# Altium schematic sheet TX.SchDoc
size 420 x 297 mm; SheetNumber: 2; SheetTotal: 4
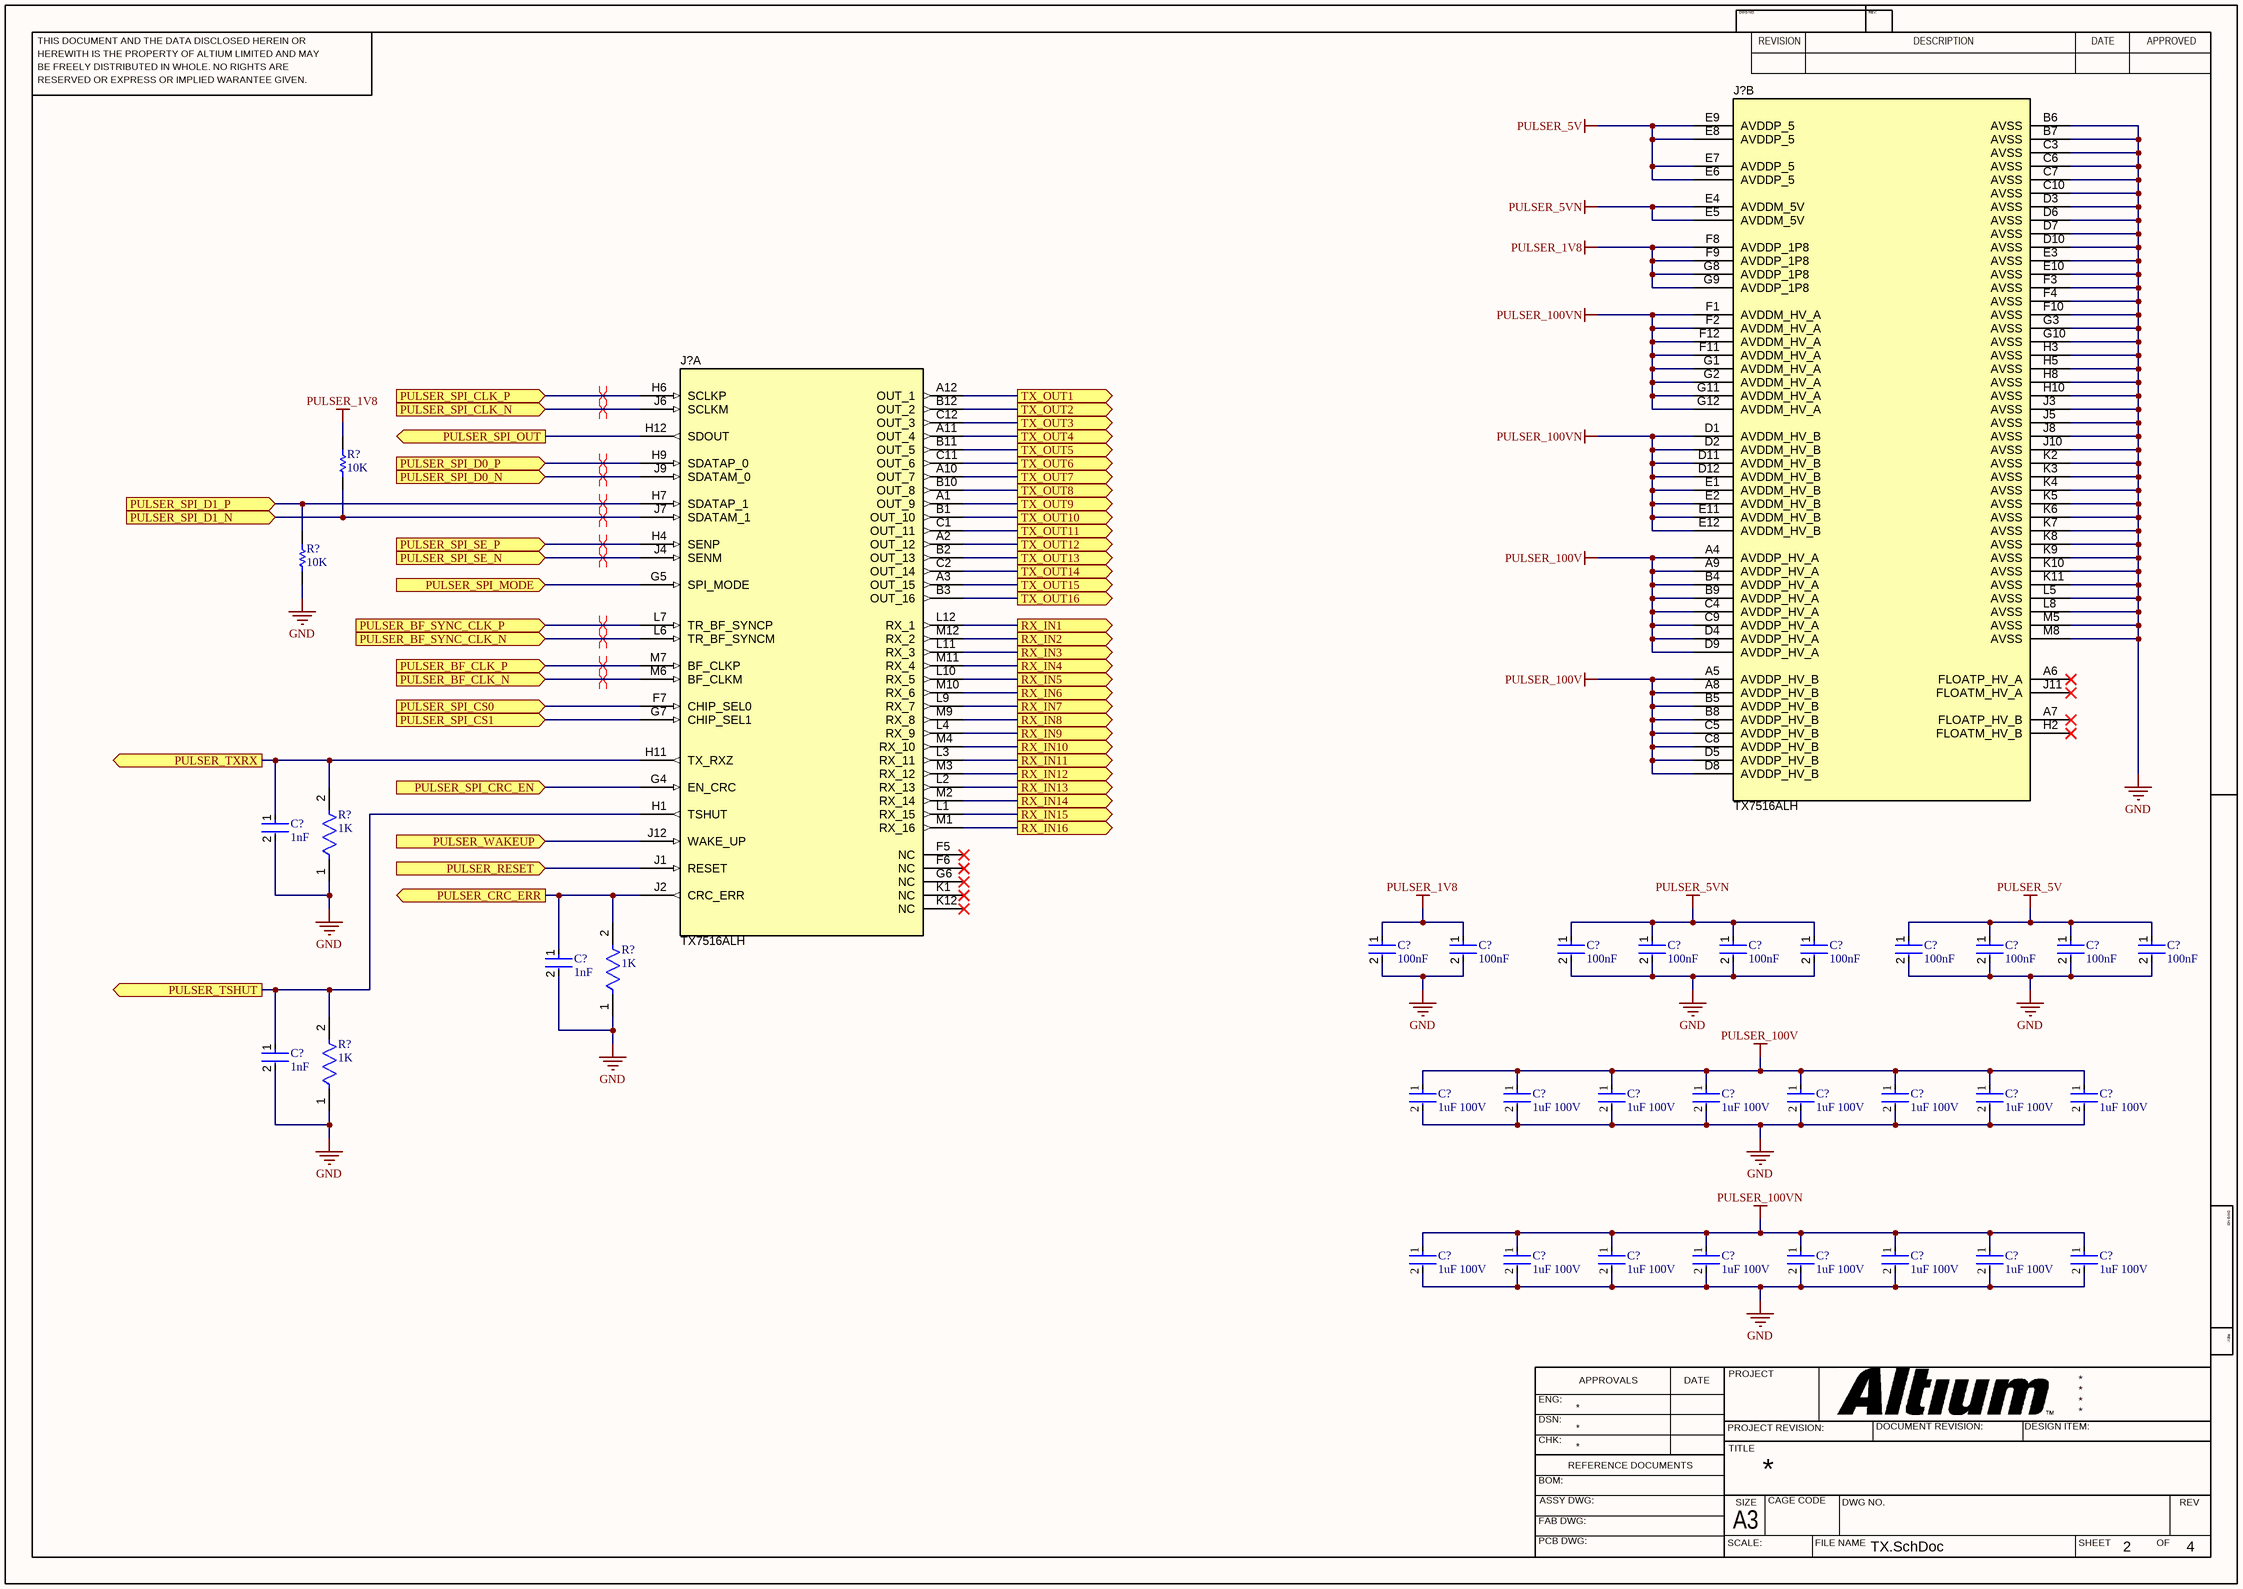
[diagram p0: TX.SchDoc]

## Parts
(Parts that share a designator on the sheet are numbered #1, #2 ... from top to bottom, then left to right.)
C?#1  1nF  [FP-C0402-BB-MFG]
C?#2  100nF  [FP-C0402-BB-MFG]
C?#3  100nF  [FP-C0402-BB-MFG]
C?#4  100nF  [FP-C0402-BB-MFG]
C?#5  100nF  [FP-C0402-BB-MFG]
C?#6  100nF  [FP-C0402-BB-MFG]
C?#7  100nF  [FP-C0402-BB-MFG]
C?#8  100nF  [FP-C0402-BB-MFG]
C?#9  100nF  [FP-C0402-BB-MFG]
C?#10  100nF  [FP-C0402-BB-MFG]
C?#11  100nF  [FP-C0402-BB-MFG]
C?#12  1nF  [FP-C0402-BB-MFG]
C?#13  1nF  [FP-C0402-BB-MFG]
C?#14  1uF 100V  [FP-0805-L_2_01_0_2-W_1_25-MFG]
C?#15  1uF 100V  [FP-0805-L_2_01_0_2-W_1_25-MFG]
C?#16  1uF 100V  [FP-0805-L_2_01_0_2-W_1_25-MFG]
C?#17  1uF 100V  [FP-0805-L_2_01_0_2-W_1_25-MFG]
C?#18  1uF 100V  [FP-0805-L_2_01_0_2-W_1_25-MFG]
C?#19  1uF 100V  [FP-0805-L_2_01_0_2-W_1_25-MFG]
C?#20  1uF 100V  [FP-0805-L_2_01_0_2-W_1_25-MFG]
C?#21  1uF 100V  [FP-0805-L_2_01_0_2-W_1_25-MFG]
C?#22  1uF 100V  [FP-0805-L_2_01_0_2-W_1_25-MFG]
C?#23  1uF 100V  [FP-0805-L_2_01_0_2-W_1_25-MFG]
C?#24  1uF 100V  [FP-0805-L_2_01_0_2-W_1_25-MFG]
C?#25  1uF 100V  [FP-0805-L_2_01_0_2-W_1_25-MFG]
C?#26  1uF 100V  [FP-0805-L_2_01_0_2-W_1_25-MFG]
C?#27  1uF 100V  [FP-0805-L_2_01_0_2-W_1_25-MFG]
C?#28  1uF 100V  [FP-0805-L_2_01_0_2-W_1_25-MFG]
C?#29  1uF 100V  [FP-0805-L_2_01_0_2-W_1_25-MFG]
J?#1  TX7516ALH  [ALH0144A]  (part B of 2)
J?#2  TX7516ALH  [ALH0144A]  (part A of 2)
R?#1  10K  [RESC1005X40X20NL05T10]
R?#2  10K  [RESC1005X40X20NL05T10]
R?#3  1K  [FP-CRGCQ0402-IPC_C]
R?#4  1K  [FP-CRGCQ0402-IPC_C]
R?#5  1K  [FP-CRGCQ0402-IPC_C]

## Ports
PULSER_BF_CLK_N (in), PULSER_BF_CLK_P (in), PULSER_BF_SYNC_CLK_N (in), PULSER_BF_SYNC_CLK_P (in), PULSER_CRC_ERR (out), PULSER_RESET (in), PULSER_SPI_CLK_N (in), PULSER_SPI_CLK_P (in), PULSER_SPI_CRC_EN (in), PULSER_SPI_CS0 (in), PULSER_SPI_CS1 (in), PULSER_SPI_D0_N (in), PULSER_SPI_D0_P (in), PULSER_SPI_D1_N (in), PULSER_SPI_D1_P (in), PULSER_SPI_MODE (in), PULSER_SPI_OUT (out), PULSER_SPI_SE_N (in), PULSER_SPI_SE_P (in), PULSER_TSHUT (out), PULSER_TXRX (out), PULSER_WAKEUP (in), RX_IN1 (out), RX_IN2 (out), RX_IN3 (out), RX_IN4 (out), RX_IN5 (out), RX_IN6 (out), RX_IN7 (out), RX_IN8 (out), RX_IN9 (out), RX_IN10 (out), RX_IN11 (out), RX_IN12 (out), RX_IN13 (out), RX_IN14 (out), RX_IN15 (out), RX_IN16 (out), TX_OUT1 (out), TX_OUT2 (out), TX_OUT3 (out), TX_OUT4 (out), TX_OUT5 (out), TX_OUT6 (out), TX_OUT7 (out), TX_OUT8 (out), TX_OUT9 (out), TX_OUT10 (out), TX_OUT11 (out), TX_OUT12 (out), TX_OUT13 (out), TX_OUT14 (out), TX_OUT15 (out), TX_OUT16 (out)

## Nets
GND: C?#1.2 C?#2.2 C?#3.2 C?#4.2 C?#5.2 C?#6.2 C?#7.2 C?#8.2 C?#9.2 C?#10.2 C?#11.2 C?#12.2 C?#13.2 C?#14.2 C?#15.2 C?#16.2 C?#17.2 C?#18.2 C?#19.2 C?#20.2 C?#21.2 C?#22.2 C?#23.2 C?#24.2 C?#25.2 C?#26.2 C?#27.2 C?#28.2 C?#29.2 J?#1.B6(AVSS) J?#1.B7(AVSS) J?#1.C3(AVSS) J?#1.C6(AVSS) J?#1.C7(AVSS) J?#1.C10(AVSS) J?#1.D3(AVSS) J?#1.D6(AVSS) J?#1.D7(AVSS) J?#1.D10(AVSS) J?#1.E3(AVSS) J?#1.E10(AVSS) J?#1.F3(AVSS) J?#1.F4(AVSS) J?#1.F10(AVSS) J?#1.G3(AVSS) J?#1.G10(AVSS) J?#1.H3(AVSS) J?#1.H5(AVSS) J?#1.H8(AVSS) J?#1.H10(AVSS) J?#1.J3(AVSS) J?#1.J5(AVSS) J?#1.J8(AVSS) J?#1.J10(AVSS) J?#1.K2(AVSS) J?#1.K3(AVSS) J?#1.K4(AVSS) J?#1.K5(AVSS) J?#1.K6(AVSS) J?#1.K7(AVSS) J?#1.K8(AVSS) J?#1.K9(AVSS) J?#1.K10(AVSS) J?#1.K11(AVSS) J?#1.L5(AVSS) J?#1.L8(AVSS) J?#1.M5(AVSS) J?#1.M8(AVSS) R?#2.1 R?#3.1 R?#4.1 R?#5.1
PULSER_1V8: C?#2.1 C?#3.1 J?#1.F8(AVDDP_1P8) J?#1.F9(AVDDP_1P8) J?#1.G8(AVDDP_1P8) J?#1.G9(AVDDP_1P8) R?#1.2
PULSER_5V: C?#8.1 C?#9.1 C?#10.1 C?#11.1 J?#1.E6(AVDDP_5) J?#1.E7(AVDDP_5) J?#1.E8(AVDDP_5) J?#1.E9(AVDDP_5)
PULSER_5VN: C?#4.1 C?#5.1 C?#6.1 C?#7.1 J?#1.E4(AVDDM_5V) J?#1.E5(AVDDM_5V)
PULSER_100V: C?#14.1 C?#15.1 C?#16.1 C?#17.1 C?#18.1 C?#19.1 C?#20.1 C?#21.1 J?#1.A4(AVDDP_HV_A) J?#1.A5(AVDDP_HV_B) J?#1.A8(AVDDP_HV_B) J?#1.A9(AVDDP_HV_A) J?#1.B4(AVDDP_HV_A) J?#1.B5(AVDDP_HV_B) J?#1.B8(AVDDP_HV_B) J?#1.B9(AVDDP_HV_A) J?#1.C4(AVDDP_HV_A) J?#1.C5(AVDDP_HV_B) J?#1.C8(AVDDP_HV_B) J?#1.C9(AVDDP_HV_A) J?#1.D4(AVDDP_HV_A) J?#1.D5(AVDDP_HV_B) J?#1.D8(AVDDP_HV_B) J?#1.D9(AVDDP_HV_A)
PULSER_100VN: C?#22.1 C?#23.1 C?#24.1 C?#25.1 C?#26.1 C?#27.1 C?#28.1 C?#29.1 J?#1.D1(AVDDM_HV_B) J?#1.D2(AVDDM_HV_B) J?#1.D11(AVDDM_HV_B) J?#1.D12(AVDDM_HV_B) J?#1.E1(AVDDM_HV_B) J?#1.E2(AVDDM_HV_B) J?#1.E11(AVDDM_HV_B) J?#1.E12(AVDDM_HV_B) J?#1.F1(AVDDM_HV_A) J?#1.F2(AVDDM_HV_A) J?#1.F11(AVDDM_HV_A) J?#1.F12(AVDDM_HV_A) J?#1.G1(AVDDM_HV_A) J?#1.G2(AVDDM_HV_A) J?#1.G11(AVDDM_HV_A) J?#1.G12(AVDDM_HV_A)
PULSER_BF_CLK_N: J?#2.M6(BF_CLKM) ; port PULSER_BF_CLK_N
PULSER_BF_CLK_P: J?#2.M7(BF_CLKP) ; port PULSER_BF_CLK_P
PULSER_BF_SYNC_CLK_N: J?#2.L6(TR_BF_SYNCM) ; port PULSER_BF_SYNC_CLK_N
PULSER_BF_SYNC_CLK_P: J?#2.L7(TR_BF_SYNCP) ; port PULSER_BF_SYNC_CLK_P
PULSER_CRC_ERR: C?#12.1 J?#2.J2(CRC_ERR) R?#4.2 ; port PULSER_CRC_ERR
PULSER_RESET: J?#2.J1(RESET) ; port PULSER_RESET
PULSER_SPI_CLK_N: J?#2.J6(SCLKM) ; port PULSER_SPI_CLK_N
PULSER_SPI_CLK_P: J?#2.H6(SCLKP) ; port PULSER_SPI_CLK_P
PULSER_SPI_CRC_EN: J?#2.G4(EN_CRC) ; port PULSER_SPI_CRC_EN
PULSER_SPI_CS0: J?#2.F7(CHIP_SEL0) ; port PULSER_SPI_CS0
PULSER_SPI_CS1: J?#2.G7(CHIP_SEL1) ; port PULSER_SPI_CS1
PULSER_SPI_D0_N: J?#2.J9(SDATAM_0) ; port PULSER_SPI_D0_N
PULSER_SPI_D0_P: J?#2.H9(SDATAP_0) ; port PULSER_SPI_D0_P
PULSER_SPI_D1_N: J?#2.J7(SDATAM_1) R?#1.1 ; port PULSER_SPI_D1_N
PULSER_SPI_D1_P: J?#2.H7(SDATAP_1) R?#2.2 ; port PULSER_SPI_D1_P
PULSER_SPI_MODE: J?#2.G5(SPI_MODE) ; port PULSER_SPI_MODE
PULSER_SPI_OUT: J?#2.H12(SDOUT) ; port PULSER_SPI_OUT
PULSER_SPI_SE_N: J?#2.J4(SENM) ; port PULSER_SPI_SE_N
PULSER_SPI_SE_P: J?#2.H4(SENP) ; port PULSER_SPI_SE_P
PULSER_TSHUT: C?#13.1 J?#2.H1(TSHUT) R?#5.2 ; port PULSER_TSHUT
PULSER_TXRX: C?#1.1 J?#2.H11(TX_RXZ) R?#3.2 ; port PULSER_TXRX
PULSER_WAKEUP: J?#2.J12(WAKE_UP) ; port PULSER_WAKEUP
RX_IN1: J?#2.L12(RX_1) ; port RX_IN1
RX_IN2: J?#2.M12(RX_2) ; port RX_IN2
RX_IN3: J?#2.L11(RX_3) ; port RX_IN3
RX_IN4: J?#2.M11(RX_4) ; port RX_IN4
RX_IN5: J?#2.L10(RX_5) ; port RX_IN5
RX_IN6: J?#2.M10(RX_6) ; port RX_IN6
RX_IN7: J?#2.L9(RX_7) ; port RX_IN7
RX_IN8: J?#2.M9(RX_8) ; port RX_IN8
RX_IN9: J?#2.L4(RX_9) ; port RX_IN9
RX_IN10: J?#2.M4(RX_10) ; port RX_IN10
RX_IN11: J?#2.L3(RX_11) ; port RX_IN11
RX_IN12: J?#2.M3(RX_12) ; port RX_IN12
RX_IN13: J?#2.L2(RX_13) ; port RX_IN13
RX_IN14: J?#2.M2(RX_14) ; port RX_IN14
RX_IN15: J?#2.L1(RX_15) ; port RX_IN15
RX_IN16: J?#2.M1(RX_16) ; port RX_IN16
TX_OUT1: J?#2.A12(OUT_1) ; port TX_OUT1
TX_OUT2: J?#2.B12(OUT_2) ; port TX_OUT2
TX_OUT3: J?#2.C12(OUT_3) ; port TX_OUT3
TX_OUT4: J?#2.A11(OUT_4) ; port TX_OUT4
TX_OUT5: J?#2.B11(OUT_5) ; port TX_OUT5
TX_OUT6: J?#2.C11(OUT_6) ; port TX_OUT6
TX_OUT7: J?#2.A10(OUT_7) ; port TX_OUT7
TX_OUT8: J?#2.B10(OUT_8) ; port TX_OUT8
TX_OUT9: J?#2.A1(OUT_9) ; port TX_OUT9
TX_OUT10: J?#2.B1(OUT_10) ; port TX_OUT10
TX_OUT11: J?#2.C1(OUT_11) ; port TX_OUT11
TX_OUT12: J?#2.A2(OUT_12) ; port TX_OUT12
TX_OUT13: J?#2.B2(OUT_13) ; port TX_OUT13
TX_OUT14: J?#2.C2(OUT_14) ; port TX_OUT14
TX_OUT15: J?#2.A3(OUT_15) ; port TX_OUT15
TX_OUT16: J?#2.B3(OUT_16) ; port TX_OUT16

Not connected (* = marked no-connect by the designer): J?#1 A6(FLOATP_HV_A)* A7(FLOATP_HV_B)* H2(FLOATM_HV_B)* J11(FLOATM_HV_A)*; J?#2 F5(NC)* F6(NC)* G6(NC)* K1(NC)* K12(NC)*

## Layout directives
differential pair: PULSER_BF_CLK_N, PULSER_BF_CLK_P, PULSER_BF_SYNC_CLK_N, PULSER_BF_SYNC_CLK_P, PULSER_SPI_CLK_N, PULSER_SPI_CLK_P, PULSER_SPI_D0_N, PULSER_SPI_D0_P, PULSER_SPI_D1_N, PULSER_SPI_D1_P, PULSER_SPI_SE_N, PULSER_SPI_SE_P

## Notes on the sheet
- THIS DOCUMENT AND THE DATA DISCLOSED HEREIN OR
- HEREWITH IS THE PROPERTY OF ALTIUM LIMITED AND MAY
- DWG NO:
- REVISION
- REV:
- DESCRIPTION
- DATE
- APPROVED
- BE FREELY DISTRIBUTED IN WHOLE. NO RIGHTS ARE
- RESERVED OR EXPRESS OR IMPLIED WARANTEE GIVEN.
- ENG:
- APPROVALS
- PROJECT
- DSN:
- CHK:
- REFERENCE DOCUMENTS
- PROJECT REVISION:
- TITLE
- DOCUMENT REVISION:
- DESIGN ITEM:
- BOM:
- FAB DWG:
- PCB DWG:
- ASSY DWG:
- SCALE:
- A3
- SIZE
- CAGE CODE
- FILE NAME
- DWG NO.
- SHEET
- OF
- REV

## Library data of the parts
C?#1 C?#12 C?#13 = CMP-03020-001048-2: CAP CER 1000PF 16V C0G/NP0 0402 - C0402C102J4GAC7867; Manufacturer: Kemet; Temperature Coefficient: 15%; Capacitance: 1,000 pF; Value: 1,000 pF; Material: Ceramic; Description: C0402 1,000 pF C0G 5.00% 16 V; Tolerance: 0.05; Temperature Characteristic: C0G; Temperature Range Low: -55°C; Height: 0.55mm; ComponentLink2URL: https://content.kemet.com/datasheets/KEM_C1002_X7R_SMD.pdf; Ipc Land Pattern Name: CAPC10050X50; Manufacturer Part Number: C0402C102J4GAC7867; Digikey Description: CAP CER 1000PF 16V C0G/NP0 0402; Voltage Rating: 16 V; Device Class L1: Passive Components; Category: Cap; Automotive: No; Lead Free: Yes; Temperature: -55°C to +125°C; Device Class L3: Ceramic Capacitors; ComponentLink2Description: Datasheet; Octopart: https://octopart.com/c0402c102j4gac7867-kemet-73410369; Package: C0402-BB; Temperature Range High: +125°C; RoHS: TRUE; Device Class L2: Capacitors
C?#2-C?#11 = CMP-2008-02108-2: CAP CER 0.1UF 16V X7R 0402 - C0402C104K4RACTU; Manufacturer: Kemet; Value: 0.10 μF; Tolerance: 0.1; Description: C0402 0.10 μF X7R 10.00% 16 V; Material: Ceramic; Temperature Coefficient: 15%; Voltage Rating: 16 V; Package: C0402-BB; Automotive: No; Ipc Land Pattern Name: CAPC10050X50; Device Class L3: Ceramic Capacitors; Capacitance: 0.10 μF; Octopart: https://octopart.com/c0402c104k4ractu-kemet-94158; Temperature Characteristic: X7R; Mouser Description: Cap Ceramic 0.1uF 16V X7R 10% SMD 0402 125?C Paper T/R - Tape and Reel (Alt: C0402C104K4RAC TU); ComponentLink2Description: Datasheet; Temperature Range Low: -55°C; RoHS: TRUE; Device Class L1: Passive Components; Manufacturer Part Number: C0402C104K4RACTU; Temperature Range High: +125°C; Device Class L2: Capacitors; ComponentLink2URL: https://content.kemet.com/datasheets/KEM_C1002_X7R_SMD.pdf; Category: Cap; Height: 0.55mm; Temperature: -55°C to +125°C; Lead Free: Yes; Digikey Description: CAP CER 0.1UF 16V X7R 0402
C?#14-C?#29 = CMP-07738-122049624-1: 08051C105K4T2A Cap Ceramic 1uF 100V X7R 10% Pad SMD 0805 125C Automotive T/R - 08051C105K4T2A; Capacitance: 1µF; Tolerance: 10%; Dielectric: X7R; Case/Package: 0805; Material: Ceramic; Height: 1.4mm; Voltage Rating (DC): 100V; Voltage Rating: 100V; Schedule B: 8532240020; NexarPartId: 122049624; RoHS: Compliant; Lifecycle Status: Production; Min Operating Temperature: -55°C; Max Operating Temperature: 125°C
J?#1 J?#2 = TX7516ALH: Five-Level, 16-Channel Transmitter with T/R Switch, and On-Chip Beamformer, ALH0144A (FCBGA-144); Manufacturer: Texas Instruments; SizeZ_mm: 1.321; SizeArea_mm2: 100; SizeY_mm: 10; AEC Qualified: N; AEC Category: Q200; CompType: IC; SizeAreaWB_mm2: 144; MountType: SMT; Alternate Manufacturer: Texas Instruments; ComponentLink2Description: Product Folder; ComponentLink1URL: http://www.ti.com/lit/ds/symlink/tx7516.pdf; SizeX_mm: 10; ComponentLink2URL: http://www.ti.com/product/tx7516; ComponentLink3URL: http://www.ti.com/product/tx7516/datasheet; PackageDescription: FCBGA-144; PackageReference: ALH0144A; ComponentLink1Description: Datasheet Link; ComponentLink3Description: Online Datasheet; PartId: 1; PartNumber: TX7516ALH
R?#1 R?#2 = CMP-2002-01682-1: 10K 0402 - TNPW040210K0DEED; Manufacturer: Vishay BCcomponents; Part Number: TNPW040210K0DEED
R?#3-R?#5 = CMP-03211-006314-1: CRGCQ0402 1KΩ 1% ±100ppm/°C 50V - CRGCQ0402F1K0; Manufacturer: TE Connectivity; Power Rating: 0.0625W; Tolerance: 0.01; Description: CRGCQ0402 1KΩ 1% ±100ppm/°C 50V; Composition: Thick Film; Voltage Rating: 50V; Device Class L2: Resistors; Package: CRGCQ0402; Manufacturer Part Number: CRGCQ0402F1K0; Temperature Range High: +155°C; Device Class L3: Chip SMD Resistors; Automotive: Yes; Value: 1KΩ; Ambient Temperature Range High: +70°C; Temperature Range Low: -55°C; Temperature: -55°C to +155°C; Resistance: 1KΩ; Device Class L1: Passive Components; Height: 0.4mm; Series: CRGCQ; Lead Free: Yes; ComponentLink2URL: https://www.te.com/commerce/DocumentDelivery/DDEController?Action=showdoc&DocId=Data+Sheet%7F1773204-3%7F1%7Fpdf%7FEnglish%7FENG_DS_1773204-3_1.pdf%7F4-2176347-694; Category: Res; Octopart: https://octopart.com/crgcq0402f1k0-te+connectivity-91017946; RoHS: TRUE; ComponentLink2Description: Datasheet; Ipc Land Pattern Name: RESC10050X35; Temperature Coefficient: ±100ppm/°C